# Altium project Trottinette_Connexion.PrjPcb
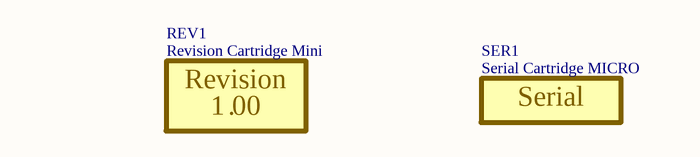
[diagram p0: Trottinette_Connexion_Title.SchDoc]
Projet_Titre: Trotinette_Connexion; Projet_stencil_Top_epaisseur: 0.1 MM; Projet_stencil_Bot_epaisseur: 0.1 MM; Projet_SCH_Rev: 00; Projet_PCB_Rev: 1; Projet_nom_du_cours: 247-67P-SH PROJET DE FIN D'ÉTUDES; Projet_Date: 22 janvier 2025; Projet_Concepteur2: Lucas Lalumière-Longpré; Projet_Concepteur1: Marc-Antoine Sauvé
3 sheets, 20 parts. Net scope: flat (ports and power ports of the same name join across sheets).
Board file: Trottinette_Connexion_2L.PcbDoc
Sheets:
  Trottinette_Connexion_Title.SchDoc
  Trottinette_Connexion_overview.SchDoc
  Trottinette_Connexion_PCB.SchDoc

## Sheet Trottinette_Connexion_Title.SchDoc
size Tabloid; Date: Date; Author: Author 1; Revision: 1; SheetNumber: 1; SheetTotal: 3; Size: 11x17; Sheet_Name: Sheet Description

### Parts
REV1  Revision Cartridge Mini  [REV_REVISION_CARTRIDGE_MINI]  (no BOM)
SER1  Serial Cartridge MICRO  [SER_SERIAL_CARTRIDGE_MICRO]  (no BOM)

### Notes on the sheet
- Projet initial
- Historique de révision
- 1.0
- Légende
- Conversion des boitiers
- Notes Générales
- Métrique
- 1005
- 1608
- Impérial
- 0402
- 0603
- Revision
- .
- Notes PCB
- 2012
- 3216
- 0805
- 1206
- Notes Programmation
- 3225
- 6432
- 1210
- 2512
- Date :
- Variants
- RÉVISION & NUMÉRO DE SÉRIE
- Titre du projet
- Cours associé au projet
- Taille
- Département
- Technologies du
- Révision
- PCB
- SCH
- Date
- génie électrique
- Feuille
- Variant
- de
- Concepteurs
- (in symbol REV_REVISION_CARTRIDGE_MINI) Revision; .
- (in symbol SER_SERIAL_CARTRIDGE_MICRO) Serial

### Library data of the parts
REV1 = REV_REVISION_CARTRIDGE_MINI: REV - REVISION CARTRIDGE MINI; Rule: UNIONINDEX=0|RULEKIND=ComponentClearance|NETSCOPE=AnyNet|LAYERKIND=SameLayer|NAME=Schematic Component Clearance Constraint|GAP=0mil|COLLISIONCHECKMODE=3|VERTICALGAP=0mil|SHOWDISTANCES=FALSE|UNIT=Imperial; Value: *; Power Max: *; HelpURL: *; Package: *; Manufacturer #1: *; Note: *; Assembly Type: NONE; Part Number #1: *; Polarized: *; Supplier 1: *; Supplier Part Number 1: *
SER1 = SER_SERIAL_CARTRIDGE_MICRO: SER - SERIAL CARTRIDGE MICRO; Rule: UNIONINDEX=0|RULEKIND=ComponentClearance|NETSCOPE=AnyNet|LAYERKIND=SameLayer|NAME=Schematic Component Clearance Constraint|GAP=0mil|COLLISIONCHECKMODE=3|VERTICALGAP=0mil|SHOWDISTANCES=FALSE|UNIT=Imperial; Value: *; Power Max: *; HelpURL: *; Package: *; Manufacturer #1: *; Note: *; Assembly Type: NONE; Part Number #1: *; Polarized: *; Supplier 1: *; Supplier Part Number 1: *

## Sheet Trottinette_Connexion_overview.SchDoc
size Tabloid; Date: Date; Author: Author 1; Revision: 1; SheetNumber: 2; SheetTotal: 3; Size: 11x17; Sheet_Name: Schéma fonctionnel

### Notes on the sheet
- Nom de la feuille
- Titre du projet
- Cours associé au projet
- Taille
- Département
- Technologies du
- Révision
- PCB
- .
- SCH
- Date
- génie électrique
- Feuille
- Variant
- de
- Concepteurs
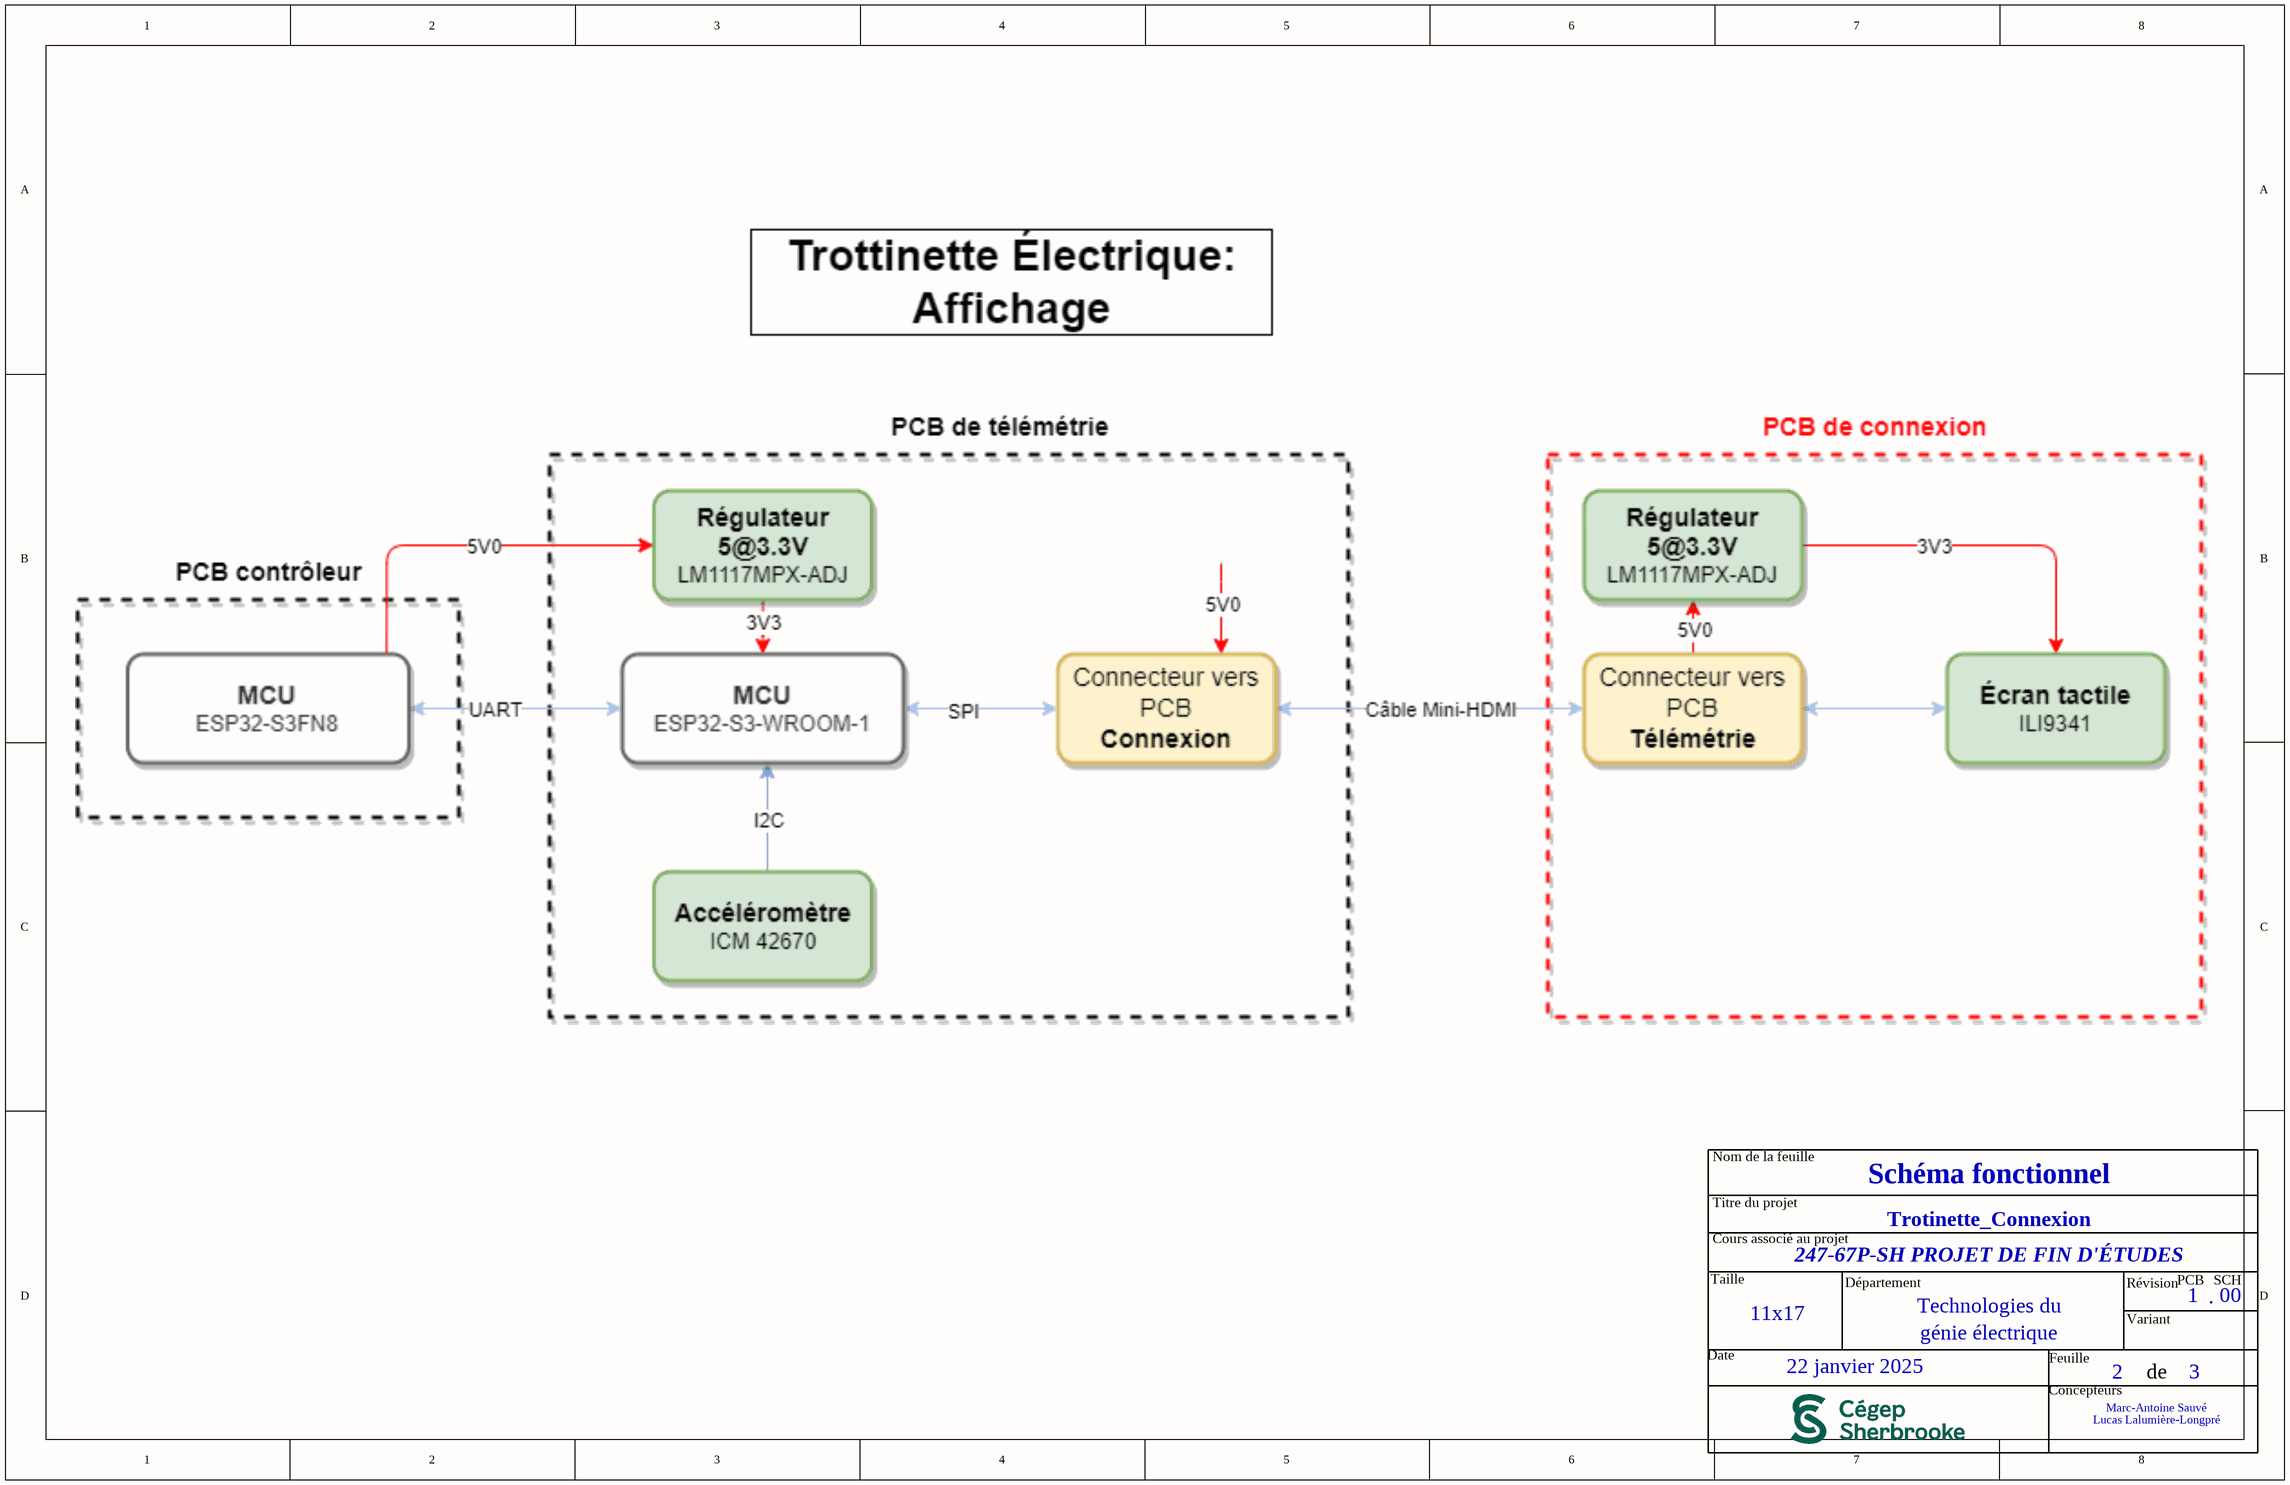
[diagram p1: Trottinette_Connexion_overview.SchDoc]

## Sheet Trottinette_Connexion_PCB.SchDoc
size Tabloid; SheetNumber: 3; SheetTotal: 3; Sheet_Name: Connecteurs; Size: 11x17
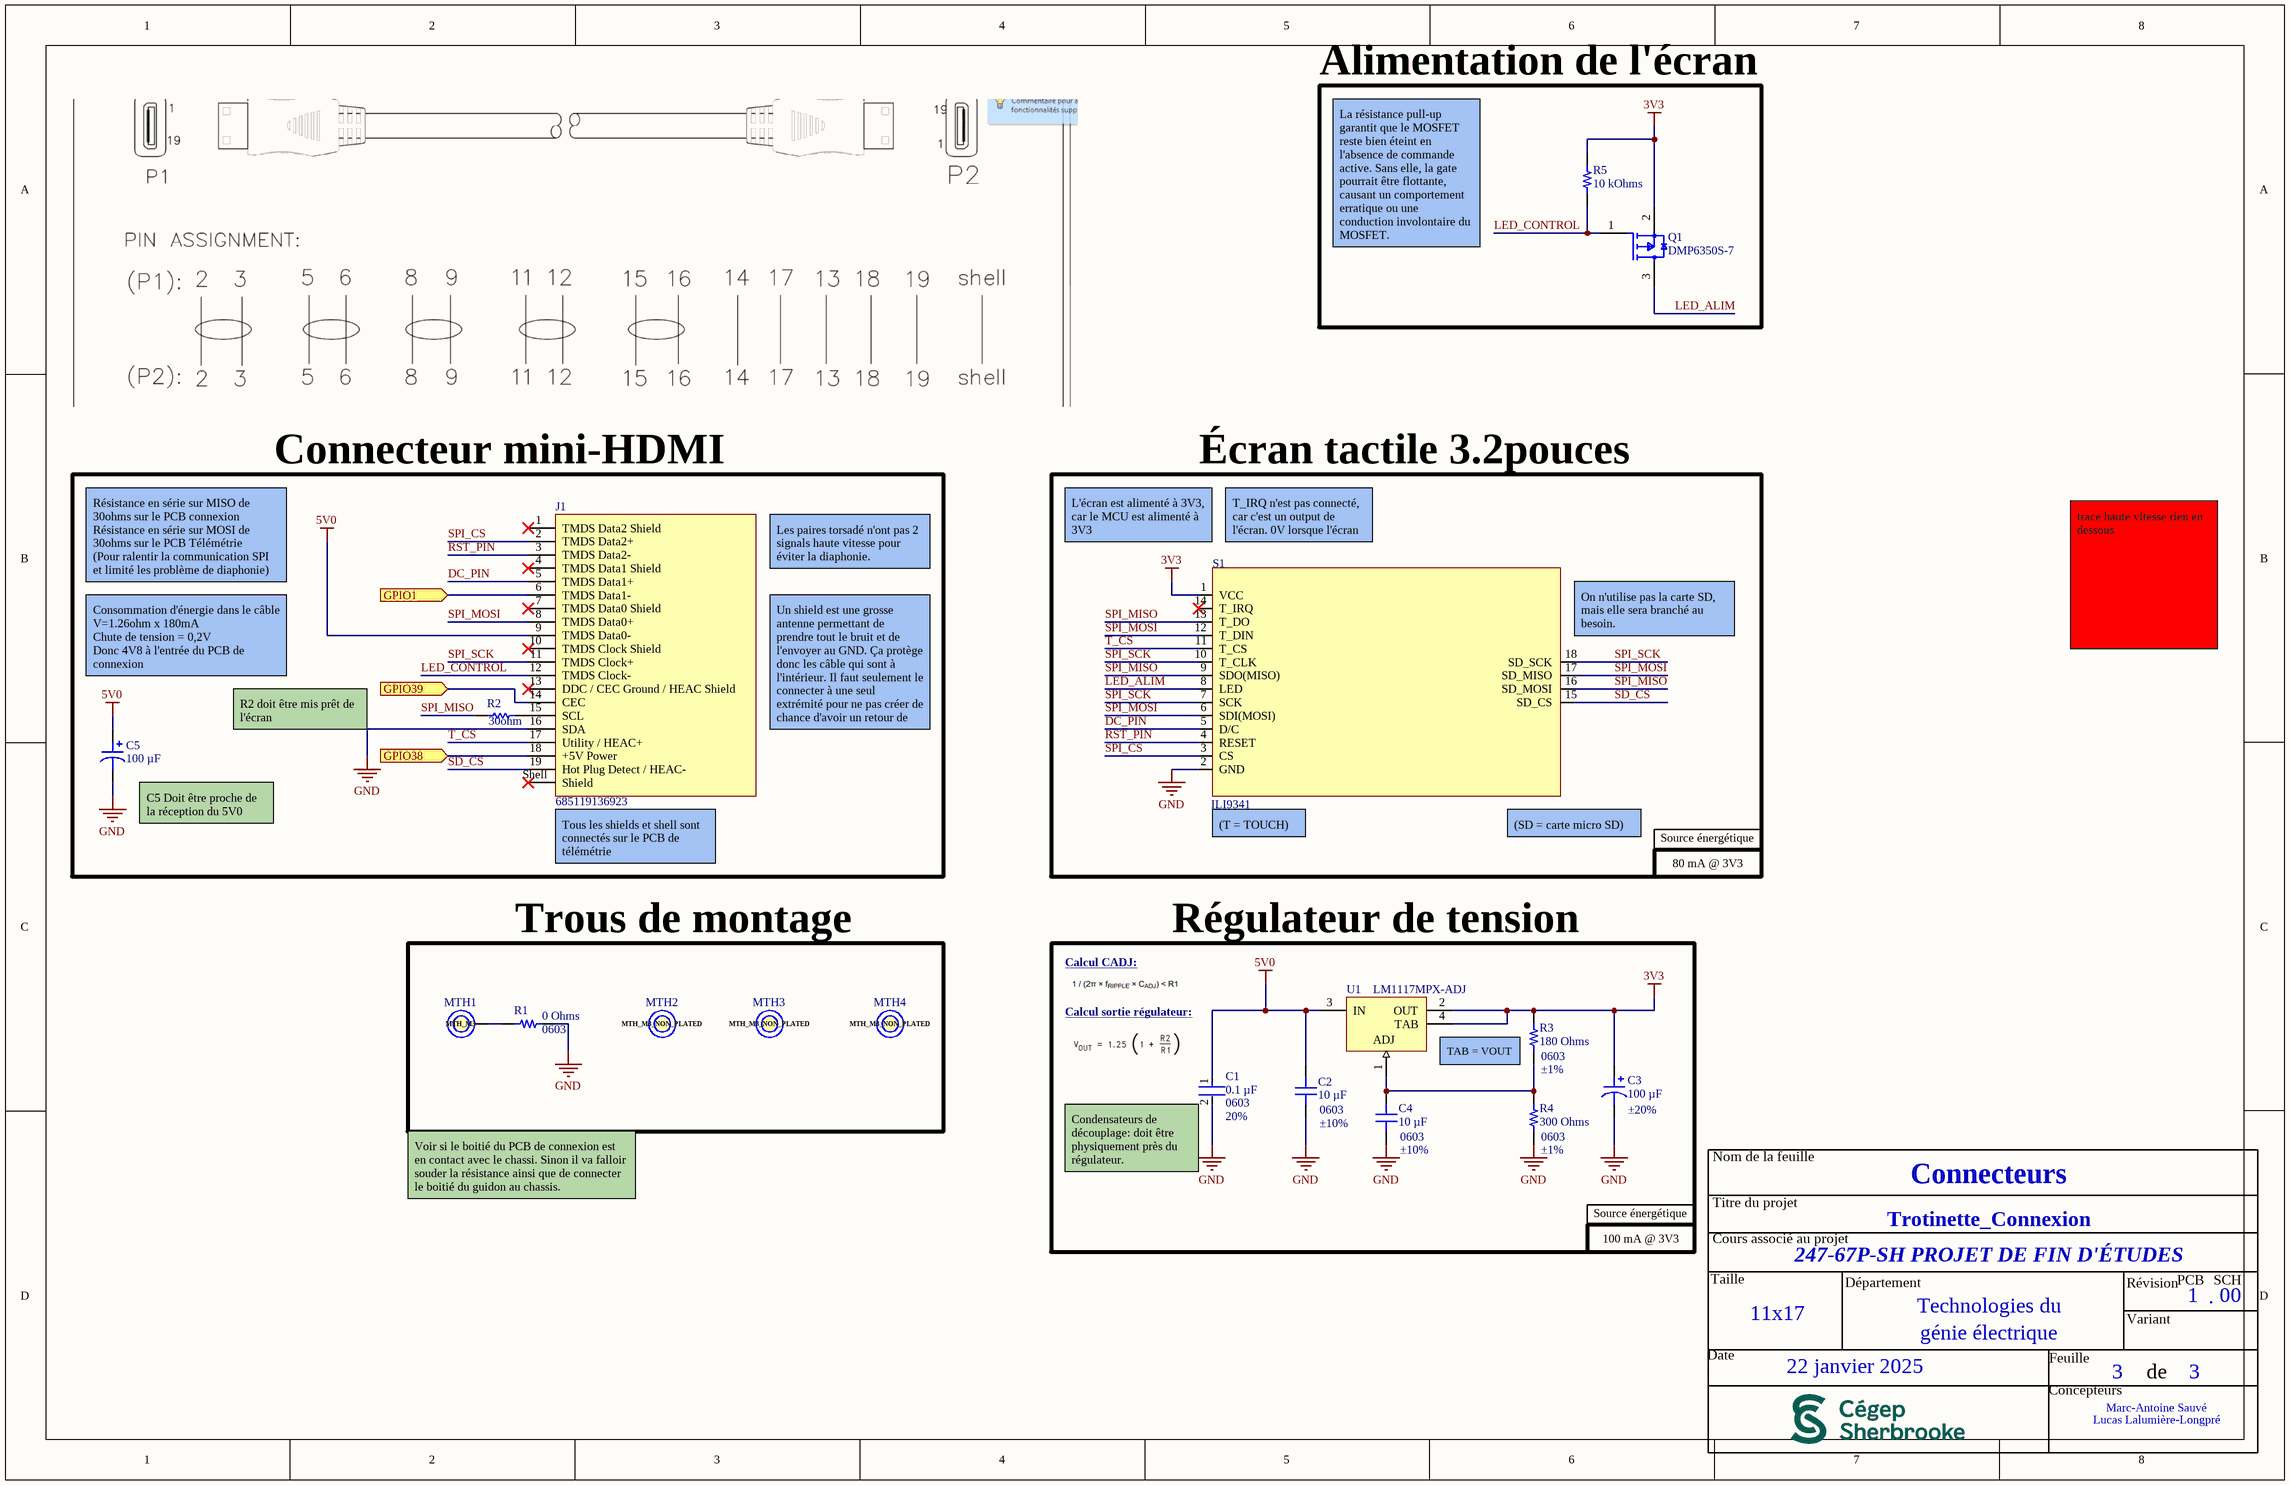
[diagram p2: Trottinette_Connexion_PCB.SchDoc]

### Parts
C1  Case Code (Imperial): 0603  Tolerance: 20%  Capacitance: 0.1 µF  [FP-0603-L_1_6_0_15-W_0_81-IPC_B]  (hidden comment: 0603ZC104MAT2A)
C2  Device Package: 0603  Tolerance: ±10%  [CAP 0603_1608]  (hidden comment: 10 µF)
C3  100 µF  Tolerance: ±20%  [CAP ALSMD 6.6MM H6.1MM]
C4  Device Package: 0603  Tolerance: ±10%  [CAP 0603_1608]  (hidden comment: 10 µF)
C5  100 µF  [CAP ALSMD 6.6MM H6.1MM]
J1  685119136923  [685119136923]
MTH1  MTH_M3  [MTH_M3]  (no BOM)
MTH2  MTH_M3_NON_PLATED  [MTH_M3_NON_PLATED]  (no BOM)
MTH3  MTH_M3_NON_PLATED  [MTH_M3_NON_PLATED]  (no BOM)
MTH4  MTH_M3_NON_PLATED  [MTH_M3_NON_PLATED]  (no BOM)
Q1  DMP6350S-7  [FP-SOT23-MFG]
R1  Supplier Device Package: 0603  [RES 0603_1608]  (hidden comment: 0 Ohms)
R2  value 30ohm  [RESC1608X55X30LL15T15]  (hidden comment: ERJ3EKF30R0V)
R3  Device Package: 0603  Tolerance: ±1%  [RES 0603_1608]  (hidden comment: 180 Ohms)
R4  Supplier Device Package: 0603  Tolerance: ±1%  [RES 0603_1608]  (hidden comment: 300 Ohms)
R5  10 kOhms  [RES 0603_1608]
S1  ILI9341  [PCBComponent_1]
U1  LM1117MPX-ADJ  [MP04A_N]

### Blocks framed on the sheet
Alimentation de l'écran: Q1 R5
Connecteur mini-HDMI: C5 J1 R2
Écran tactile 3.2pouces: S1
Trous de montage: MTH1-MTH4 R1
Régulateur de tension: C1-C4 R3 R4 U1

### Ports
GPIO1 (in), GPIO38 (in), GPIO39 (in)

### Nets
3V3: C3.1 Q1.2(S) R3.2 R5.2 S1.1(VCC) U1.2(OUT) U1.4(TAB)
5V0: C1.1 C2.2 C5.1 J1.9(TMDS_Data0-) U1.3(IN)
GND: C1.2 C2.1 C3.2 C4.1 C5.2 J1.16(SDA) R1.2 R4.2 S1.2(GND)
DC_PIN: J1.5(TMDS_Data1+) S1.5(D/C)
GPIO1: J1.6(TMDS_Data1-) ; port GPIO1
GPIO38: J1.18(+5V_Power) ; port GPIO38
GPIO39: J1.14(CEC) ; port GPIO39
LED_ALIM: Q1.3(D) S1.8(LED)
LED_CONTROL: J1.12(TMDS_Clock-) Q1.1(G) R5.1
RST_PIN: J1.3(TMDS_Data2-) S1.4(RESET)
SD_CS: J1.19(Hot_Plug_Detect_/_HEAC-) S1.15(SD_CS)
SPI_CS: J1.2(TMDS_Data2+) S1.3(CS)
SPI_MISO: R2.2 S1.9(SDO(MISO)) S1.13(T_DO) S1.16(SD_MOSI)
SPI_MOSI: J1.8(TMDS_Data0+) S1.6(SDI(MOSI)) S1.12(T_DIN) S1.17(SD_MISO)
SPI_SCK: J1.11(TMDS_Clock+) S1.7(SCK) S1.10(T_CLK) S1.18(SD_SCK)
T_CS: J1.17(Utility_/_HEAC+) S1.11(T_CS)
NetC4_2: C4.2 R3.1 R4.1 U1.1(ADJ)
NetJ1_15: J1.15(SCL) R2.1
NetMTH1_1: MTH1.1 R1.1

Not connected (* = marked no-connect by the designer): J1 1(TMDS_Data2_Shield)* 4(TMDS_Data1_Shield)* 7(TMDS_Data0_Shield)* 10(TMDS_Clock_Shield)* 13(DDC_/_CEC_Ground_/_HEAC_Shield)* Shell(Shield)*; S1 14(T_IRQ)*

### Notes on the sheet
- La résistance pull-up garantit que le MOSFET reste bien éteint en l'absence de commande active. Sans elle, la gate pourrait être flottante, causant un comportement erratique ou une conduction involontaire du MOSFET.
- Les paires torsadé n'ont pas 2 signals haute vitesse pour éviter la diaphonie.
- L'écran est alimenté à 3V3, car le MCU est alimenté à 3V3
- T_IRQ n'est pas connecté, car c'est un output de l'écran. 0V lorsque l'écran est touché
- Résistance en série sur MISO de 30ohms sur le PCB connexion
  Résistance en série sur MOSI de 30ohms sur le PCB Télémétrie
  (Pour ralentir la communication SPI et limité les problème de diaphonie)
- (near S1) On n'utilise pas la carte SD, mais elle sera branché au besoin.
- Consommation d'énergie dans le câble
  V=1.26ohm x 180mA
  Chute de tension = 0,2V
  Donc 4V8 à l'entrée du PCB de connexion
- trace haute vitesse rien en dessous
- R2 doit être mis prêt de l'écran
- Un shield est une grosse antenne permettant de prendre tout le bruit et de l'envoyer au GND. Ça protège donc les câble qui sont à l'intérieur. Il faut seulement le connecter à une seul extrémité pour ne pas créer de chance d'avoir un retour de courant.
- (near C5) C5 Doit être proche de la réception du 5V0
- (near S1) (T = TOUCH)
- (near S1) (SD = carte micro SD)
- (near J1) Tous les shields et shell sont connectés sur le PCB de télémétrie
- Source énergétique
- 80 mA @ 3V3
- Calcul CADJ:
- Calcul sortie régulateur:
- TAB = VOUT
- (near C1) Condensateurs de découplage: doit être physiquement près du régulateur.
- Voir si le boitié du PCB de connexion est en contact avec le chassi. Sinon il va falloir souder la résistance ainsi que de connecter le boitié du guidon au chassis.
- 100 mA @ 3V3
- Nom de la feuille
- Titre du projet
- Cours associé au projet
- Taille
- Département
- Technologies du
- Révision
- PCB
- .
- SCH
- Date
- génie électrique
- Feuille
- Variant
- de
- Concepteurs

### Library data of the parts
C1 = CMP-2006-04550-2: General Purpose Ceramic Capacitor, 0603, 100nF, 20%, X7R, 15%, 10V; Mount: Surface Mount; Package Quantity: 4000; RoHS Compliant: Yes; Voltage Rating: 10V; Packaging: Tape and Reel; Series: -; Thickness: 0.035inch; Number of Pins: 2; Min Operating Temperature: -55°C; Case/Package: 0603; Length: 1.6mm; Radiation Hardening: No; Voltage Rating (DC): 10V; Depth: 0.81mm; Lead Pitch: 0.014inch; Termination: SMD/SMT; Case Code (Metric): 1608; Construction: Flat; Width: 0.032inch; Lead Free: Lead Free; Max Operating Temperature: 125°C; Dielectric: X7R
C2 C4 = GRT188R61A106KE13D: CAP CER 10UF 10V X5R 0603; manufacturer: Murata Electronics; Part Number: GRT188R61A106KE13D; Value: 10 µF; Applications: Automotive; Capacitance: 10 µF; componentlink1description: Datasheet; componentlink1url: https://search.murata.co.jp/Ceramy/image/img/A01X/G101/ENG/GRT188R61A106KE13-01.pdf; componentlink2description: DigiKey Link; componentlink2url: https://www.digikey.com/en/products/detail/murata-electronics/GRT188R61A106KE13D/5416733; Features: Derating Recommended; lastupdated: 2/9/2024 8:10:30 PM; Lifecycle Status: Active; Minimum Order: 1; Mounting Type: Surface Mount, MLCC; Operating Temperature: -55°C ~ 85°C; Package / Case: 0603 (1608 Metric); packaging: TapeAndReel; partid: 2522; Part Status: Active; price: 0.06; Ratings: AEC-Q200; series: GRT; Size / Dimension: 0.063" L x 0.031" W (1.60mm x 0.80mm); Supplier 1: DigiKey; Supplier Part Number 1: 490-12311-1-ND; Temperature Coefficient: X5R; Thickness (Max): 0.037" (0.95mm); Voltage - Rated: 10V
C3 C5 = 10SGV100M6.3X6.1: CAP ALUM 100UF 20% 10V SMD; manufacturer: Rubycon; Lifetime @ Temp.: 2000 Hrs @ 105°C; Polarization: Polar; Ripple Current @ High Frequency: 85.2 mA @ 10 kHz; Ripple Current @ Low Frequency: 71 mA @ 120 Hz; Surface Mount Land Size: 0.260" L x 0.260" W (6.60mm x 6.60mm); Part Number: 10SGV100M6.3X6.1; Applications: Automotive; Capacitance: 100 µF; componentlink1description: Datasheet; componentlink1url: http://www.rubycon.co.jp/en/catalog/e_pdfs/aluminum/e_sgv.pdf; componentlink2description: DigiKey Link; componentlink2url: https://www.digikey.com/en/products/detail/rubycon/10SGV100M6-3X6-1/3568604; Device Package: Radial, Can - SMD; Height - Seated (Max): 0.240" (6.10mm); lastupdated: 6/3/2024 8:16:10 PM; Lifecycle Status: Active; Minimum Order: 1; Mounting Type: Surface Mount; Operating Temperature: -55°C ~ 105°C; Package / Case: Radial, Can - SMD; packaging: TapeAndReel; partid: 8082; Part Status: Active; price: 0.08; Ratings: AEC-Q200; series: SGV; Size / Dimension: 0.248" Dia (6.30mm); Supplier 1: DigiKey; Supplier Part Number 1: 1189-2392-1-ND; value: 100 µF; Voltage - Rated: 10 V
  C5: Tolerance: ±20%
J1 = CMP-1502-00171-2: NexarPartId: 19499823; Number of Contacts: 19; Gender: Receptacle; Operating Supply Voltage: 40V; Contact Resistance: 30mΩ; Body Material: Brass; Connector Type: HDMI; Current Rating: 500mA; Insulation Resistance: 100MΩ; Lead Free: Lead Free; Max Operating Temperature: 85°C; Packaging: Tape and Reel; Min Operating Temperature: -25°C; Features: Shielded; Orientation: Horizontal; Height: 3.45mm; Number of Positions: 19; Voltage Rating: 40V; Number of Pins: 19; Mount: Horizontal, Surface Mount; Contact Material: Gold; Termination: SMD/SMT; Contact Plating: Gold; RoHS: Compliant; REACH SVHC: Unknown
MTH1 = CMP-006-000008-2: MTH - MOUNTING HOLE M3 PLATED - M3; Assembly Type: NONE; Component Type: Standard (No BOM); Manufacturer #1: *; Note: *; Polarized: *; Package: M3; Pin Count: 1; HelpURL: https://littlemachineshop.com/images/gallery/PDF/TapDrillSizes.pdf; Power Max: *; Value: *; Source: CEGEP_SHERBROOKE_TGE_LIBRARY.SchLib; Part Number #1: *; Design Item ID: MTH_M3
MTH2-MTH4 = CMP-006-000010-2: MTH - MOUNTING HOLE M3 NON-PLATED - M3; Component Type: Standard (No BOM); Polarized: *; Package: M3; Note: *; Value: *; Power Max: *; Pin Count: 0; HelpURL: https://littlemachineshop.com/images/gallery/PDF/TapDrillSizes.pdf; Source: CEGEP_SHERBROOKE_TGE_LIBRARY.SchLib; Assembly Type: NONE; Part Number #1: *; Design Item ID: MTH_M3_NON_PLATED; Manufacturer #1: *
Q1 = CMP-12801-000018-2: MOSFET P-CHA 60V 720MW SOT23; Input Capacitance: 206pF; Continuous Drain Current (ID): 1.5A; Rds On Max: 350mR; Max Operating Temperature: 150°C; Min Operating Temperature: -55°C; RoHS Compliant: Yes; Drain to Source Voltage (Vdss): 60V; Max Power Dissipation: 720mW; Mount: Surface Mount; Packaging: Tape and Reel; Case/Package: TO-236-3
R1 = CR0603AJ/-000EAS: RESA-AS 0603 0R JUMPER 100MW; Manufacturer: Bourns Inc.; Power (Watts): 0.1W, 1/10W; Part Number: CR0603AJ/-000EAS; Value: 0 Ohms; ComponentLink1Description: Datasheet; ComponentLink1URL: //media.digikey.com/pdf/Data%20Sheets/Bourns%20PDFs/CRyyyyA-AS_Model_DS.pdf; ComponentLink2Description: DigiKey Link; ComponentLink2URL: https://www.digikey.com/en/products/detail/bourns-inc/CR0603AJ-000EAS/10240122; Composition: Thick Film; Device Package: 0603 (1608 Metric); Features: Anti-Sulfur, Automotive AEC-Q200, Moisture Resistant; Height - Seated (Max): 0.022" (0.55mm); LastUpdated: 9/18/2023 7:33:24 PM; Lifecycle Status: Active; Minimum Order: 1; Number of Terminations: 2; Operating Temperature: -55°C ~ 155°C; Package / Case: 0603 (1608 Metric); Packaging: TapeAndReel; PartId: 24557; Part Status: Active; Price: 0.01; Ratings: AEC-Q200; Resistance: 0 Ohms; Series: CR0603A-AS; Size / Dimension: 0.063" L x 0.031" W (1.60mm x 0.80mm); Supplier 1: DigiKey; Supplier Part Number 1: CR0603AJ/-000EASCT-ND; Tolerance: Jumper
R2 = CMP-2000-00423-1: 30Ohms; Manufacturer: Panasonic; Tolerance: 1%; Part Number: ERJ3EKF30R0V
R3 = RNCP0603FTD180R: RES 180 OHM 1% 1/8W 0603; Manufacturer: Stackpole Electronics Inc; Power (Watts): 0.125W, 1/8W; Temperature Coefficient: ±100ppm/°C; Part Number: RNCP0603FTD180R; Value: 180 Ohms; ComponentLink1Description: Datasheet; ComponentLink1URL: https://www.seielect.com/catalog/sei-rncp.pdf; ComponentLink2Description: DigiKey Link; ComponentLink2URL: https://www.digikey.com/en/products/detail/stackpole-electronics-inc/RNCP0603FTD180R/2240089; Composition: Thin Film; Features: Anti-Sulfur; Height - Seated (Max): 0.022" (0.55mm); LastUpdated: 2/9/2024 8:43:33 PM; Lifecycle Status: Active; Minimum Order: 1; Number of Terminations: 2; Operating Temperature: -55°C ~ 155°C; Package / Case: 0603 (1608 Metric); Packaging: TapeAndReel; PartId: 5708; Part Status: Active; Price: 0.01; Resistance: 180 Ohms; Series: RNCP; Size / Dimension: 0.061" L x 0.031" W (1.55mm x 0.80mm); Supplier 1: DigiKey; Supplier Part Number 1: RNCP0603FTD180RCT-ND; Supplier Device Package: 0603
R4 = CRCW0603300RFKEA: RES SMD 300 OHM 1% 1/10W 0603; Manufacturer: Vishay Dale; Power (Watts): 0.1W, 1/10W; Temperature Coefficient: ±100ppm/°C; Part Number: CRCW0603300RFKEA; Value: 300 Ohms; ComponentLink1Description: Datasheet; ComponentLink1URL: http://www.vishay.com/docs/20035/dcrcwe3.pdf; ComponentLink2Description: DigiKey Link; ComponentLink2URL: https://www.digikey.com/en/products/detail/vishay-dale/CRCW0603300RFKEA/1174606; Composition: Thick Film; Device Package: 0603 (1608 Metric); Features: Automotive AEC-Q200; Height - Seated (Max): 0.020" (0.50mm); LastUpdated: 2/9/2024 8:43:25 PM; Lifecycle Status: Active; Minimum Order: 1; Number of Terminations: 2; Operating Temperature: -55°C ~ 155°C; Package / Case: 0603 (1608 Metric); Packaging: TapeAndReel; PartId: 7780; Part Status: Active; Price: 0.01; Ratings: AEC-Q200; Resistance: 300 Ohms; Series: CRCW; Size / Dimension: 0.061" L x 0.033" W (1.55mm x 0.85mm); Supplier 1: DigiKey; Supplier Part Number 1: 541-300HCT-ND
R5 = RNCS0603BKE10K0: RES 10K OHM 0.1% 1/16W 0603; Manufacturer: Stackpole Electronics Inc; Power (Watts): 0.063W, 1/16W; Temperature Coefficient: ±25ppm/°C; Part Number: RNCS0603BKE10K0; Value: 10 kOhms; ComponentLink1Description: Datasheet; ComponentLink1URL: https://www.seielect.com/catalog/sei-rncs_rnch.pdf; ComponentLink2Description: DigiKey Link; ComponentLink2URL: https://www.digikey.com/en/products/detail/stackpole-electronics-inc/RNCS0603BKE10K0/1708836; Composition: Thin Film; Device Package: 0603 (1608 Metric); Features: Anti-Corrosive, Automotive AEC-Q200, Moisture Resistant; Height - Seated (Max): 0.022" (0.55mm); LastUpdated: 2024-02-09 20:43:37; Lifecycle Status: Active; Minimum Order: 1; Number of Terminations: 2; Operating Temperature: -55°C ~ 155°C; Package / Case: 0603 (1608 Metric); Packaging: TapeAndReel; PartId: 4838; Part Status: Active; Price: 0.06; Ratings: AEC-Q200; Resistance: 10 kOhms; Series: RNCS; Size / Dimension: 0.061" L x 0.031" W (1.55mm x 0.80mm); Supplier 1: DigiKey; Supplier Part Number 1: RNCS0603BKE10K0CT-ND; Supplier Device Package: 0603; Tolerance: ±0.1%
S1 = ILI9341: 3.2" 240x320 TFT LCD ILI9341; GRAMS Lib Spec: 3.2; Magnetic Material: UNKNOWN; Cryo: UNKNOWN; Solder Paste Type: UNKNOWN; Stencil Thickness (Recommended): UNKNOWN
U1 = CMP-0062-01642-3: 800mA Low-Dropout Linear Regulator, 4-pin SOT-223; Manufacturer: National Semiconductor; CompType: LDO IC; PowerWise: N; PackageTopMarking: XYTT*N03A; High-Reliability: Y; DatasheetVersion: Apr-2006; PackageReference: MP04A; Code_JEDEC: TO-261-AA; ComponentLink2URL: http://www.national.com/ds/LM/LM1117.pdf; ComponentLink3Description: LM1117 Web Page; ComponentLink4Description: MP04A Package Page; ComponentLink2Description: LM1117 Datasheet; PinCount: 4; Code_IPC: SOT223-4; PartNumber: LM1117MPX-ADJ; ComponentLink1Description: Manufacturer URL; ComponentLink3URL: http://www.national.com/pf/LM/LM1117.html; ComponentLink4URL: http://www.national.com/packaging/folders/mp04a.html; RoHS: N; PackageDescription: Molded SOT-223, 6.50 x 3.56 x 1.6mm Body, 4 Lead, 2.3mm Pitch; RevisionNote: SCH symbol layout adjusted; ComponentLink1URL: http://www.national.com/; PackageVersion: revB, Apr-2003